# EAGLE design spider_mx8_2side (EAGLE 6.5.0)
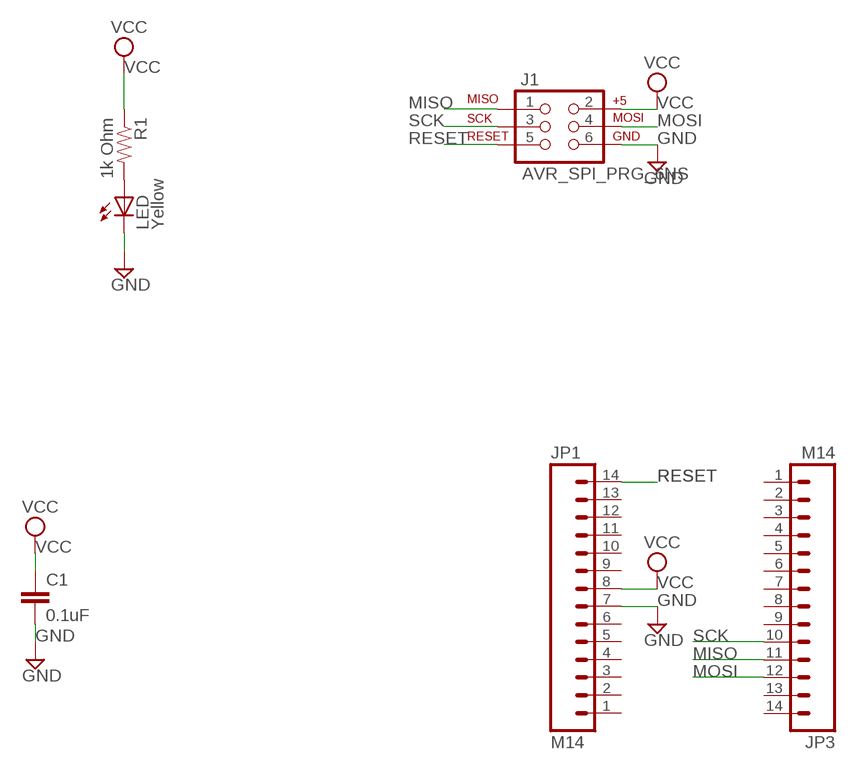
[diagram p0: schematic, sheet 1]

## Parts
C1  0.1uF  CAP1206  [1206]
J1  AVR_SPI_PRG_6NS  [2X3-NS]
JP1  M14  [1X14]
JP3  M14  [1X14]
LED  Yellow  LED-YELLOWLILYPAD  [LED-1206]
R1  1k Ohm  RESISTOR1206  [1206]

## Nets
GND: C1.2 J1.6 JP1.7 LED.C
MISO: J1.1 JP3.11
MOSI: J1.4 JP3.12
N$14: LED.A R1.2
RESET: J1.5 JP1.14
SCK: J1.3 JP3.10
VCC: C1.1 J1.2 JP1.8 R1.1
Unconnected: JP1.1 JP1.2 JP1.3 JP1.4 JP1.5 JP1.6 JP1.9 JP1.10 JP1.11 JP1.12 JP1.13 JP3.1 JP3.2 JP3.3 JP3.4 JP3.5 JP3.6 JP3.7 JP3.8 JP3.9 JP3.13 JP3.14

## Library data of the parts
C1 = SparkFun-Passives:CAP: Capacitor Standard 0603 ceramic capacitor, and 0.1" leaded capacitor.
J1 = SparkFun-Connectors:AVR_SPI_PRG_6: AVR ISP 6 Pin This is the reduced ISP connector for AVR programming. Common on Arduino. This footprint will take up less PCB space and can be used with a 10-pin to 6-pin adapter such as SKU: BOB-08508
JP1 JP3 = SparkFun-Connectors:M14: Header 14 Standard 14-pin 0.1" header. Use with straight break away headers (SKU : PRT-00116), right angle break away headers (PRT-00553), swiss pins (PRT-00743), machine pins (PRT-00117), and female headers (PRT-00115).
LED = SparkFun-LED:LED-YELLOW: Yellow SMD LEDs LilyPad 1206- DIO-09909 0603- DIO-09003; PROD_ID: DIO-09909
R1 = SparkFun-Passives:RESISTOR: Resistor Basic schematic elements and footprints for 0603, 1206, and PTH resistors.

## Board
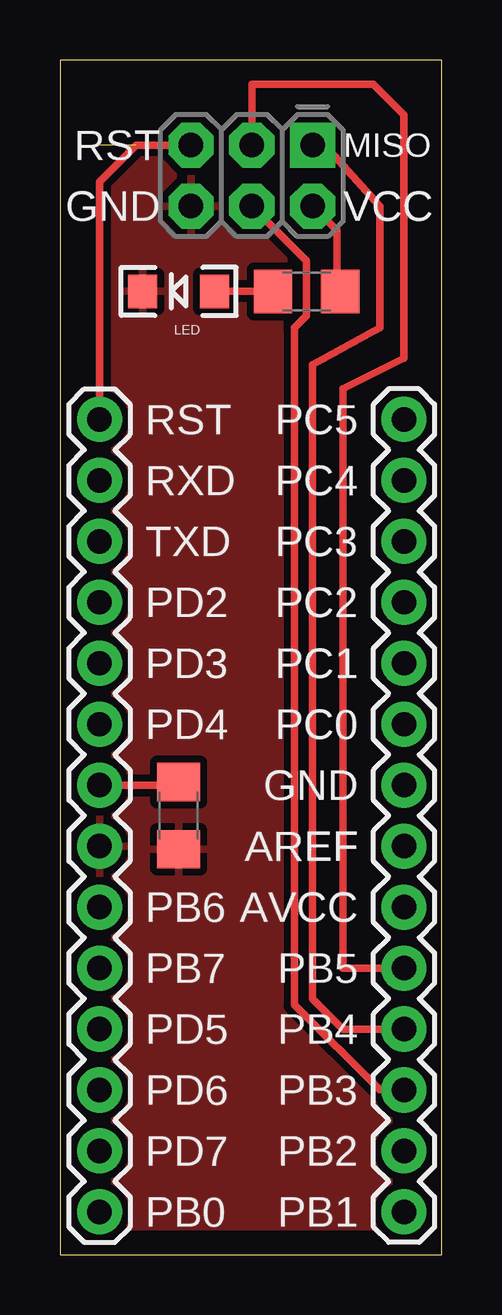
[diagram p1: board, top side]
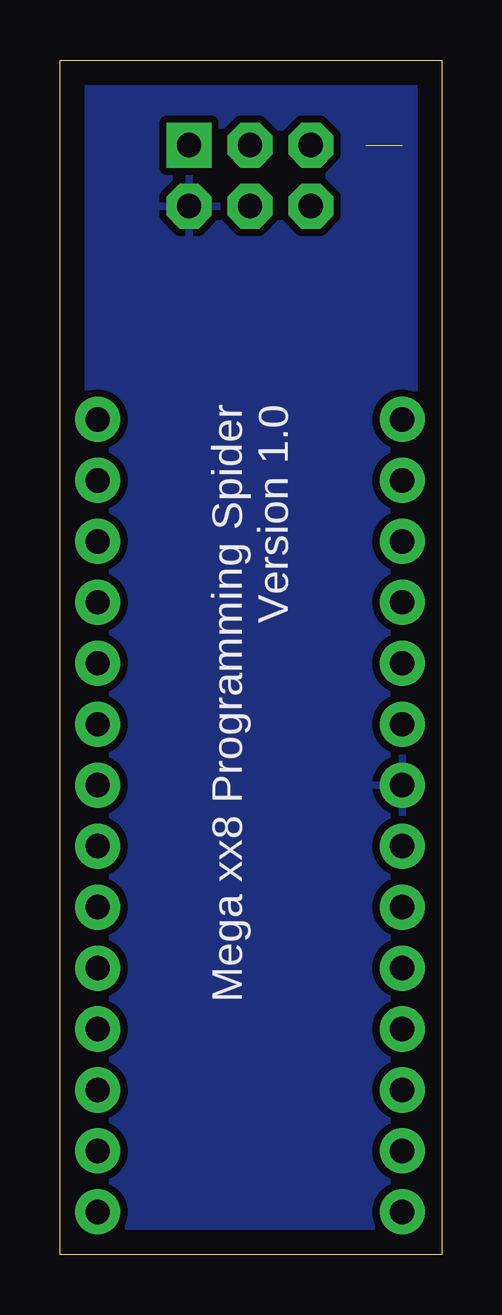
[diagram p2: board, bottom side, seen from below]

Size 15.93 x 49.77 mm. Coordinates in mm from the lower left corner, seen from the top.
Outline: 0,0 15.93,0 15.93,49.77 0,49.77 0,0
Copper layers (1*16): Top 0.035mm / dielectric 1.5mm / Bottom 0.035mm
Design rules "improved_12mil": minimum track width 12mil, minimum drill 0.8mm, track to track 12mil, track to pad 12mil, pad to pad 12mil, via to via 12mil, smd to smd 12mil, copper to edge 40mil, drill to drill 12mil, minimum pad ring 16mil, minimum via ring 16mil, stop-mask expansion 4mil, vias tented up to drill 0mil, thermal gap 12mil

### Footprints (pad centres in the part's own frame; a part is rotated, then mirrored left to right if it is on the bottom)
1206 = smd 1.6 x 1.8: 1 -1.4,0; 2 1.4,0
2X3-NS = drill 1.016 pad 1.88 square: 1 -2.54,-1.27 | drill 1.016 pad 1.88 octagon: 2 -2.54,1.27; 3 0,-1.27; 4 0,1.27; 5 2.54,-1.27; 6 2.54,1.27
1X14 = drill 1.016 pad 1.88: 1 0,0; 2 2.54,0; 3 5.08,0; 4 7.62,0; 5 10.16,0; 6 12.7,0; 7 15.24,0; 8 17.78,0; 9 20.32,0; 10 22.86,0; 11 25.4,0; 12 27.94,0; 13 30.48,0; 14 33.02,0
LED-1206 = smd 1.2 x 1.4: A -1.5,0; C 1.5,0

### Placement (x,y rotation side)
C1  4.95,18.29 270 top
J1  8,44.96 180 top
JP1  1.65,1.78 90 top
JP3  14.35,34.8 270 top
LED  4.95,40.13 180 top
R1  10.29,40.13 180 top

### Tracks (layer width: path | path; a pad name or v marks a point on that pad's centre or on a via)
GND
  Top 0.305: 4.95,17.02 C1.2
  pour Top: -0.89,50.04 -0.89,-0.76 16.89,-0.76 16.89,50.04
MISO
  Top 0.305: J1.1 11.05,46.23 13.34,43.69 13.34,38.61 10.54,37.08 10.54,10.67 11.81,9.4 JP3.11
MOSI
  Top 0.305: J1.4 10.29,41.4 10.29,39.12 9.78,38.61 9.78,10.41 13.34,6.86 JP3.12
N$14
  Top 0.305: 6.22,40.13 LED.A R1.2
RESET  (1 unrouted)
  Top 0.305: J1.5 3.17,46.23 1.65,44.7 JP1.14
SCK
  Top 0.305: J1.3 8,48.77 13.08,48.77 14.35,47.5 14.35,37.34 11.81,36.07 11.81,11.94 JP3.10
VCC
  Top 0.305: J1.2 11.56,42.67 11.56,40.13 R1.1 | JP1.8 4.95,19.56 C1.1
  pour Bottom: -0.89,50.04 -0.89,-0.76 16.89,-0.76 16.89,50.04

### Text on the board
tNames: RST | MISO | GND | VCC | RST | PC5 | RXD | PC4 | TXD | PC3 | PD2 | PC2 | PD3 | PC1 | PD4 | PC0 | GND | AREF | PB6 | AVCC | PB7 | PB5 | PD5 | PB4 | PD6 | PB3 | PD7 | PB2 | PB0 | PB1
bNames: Mega xx8 Programming Spider / Version 1.0